# EAGLE design clock (EAGLE 8.7.0)
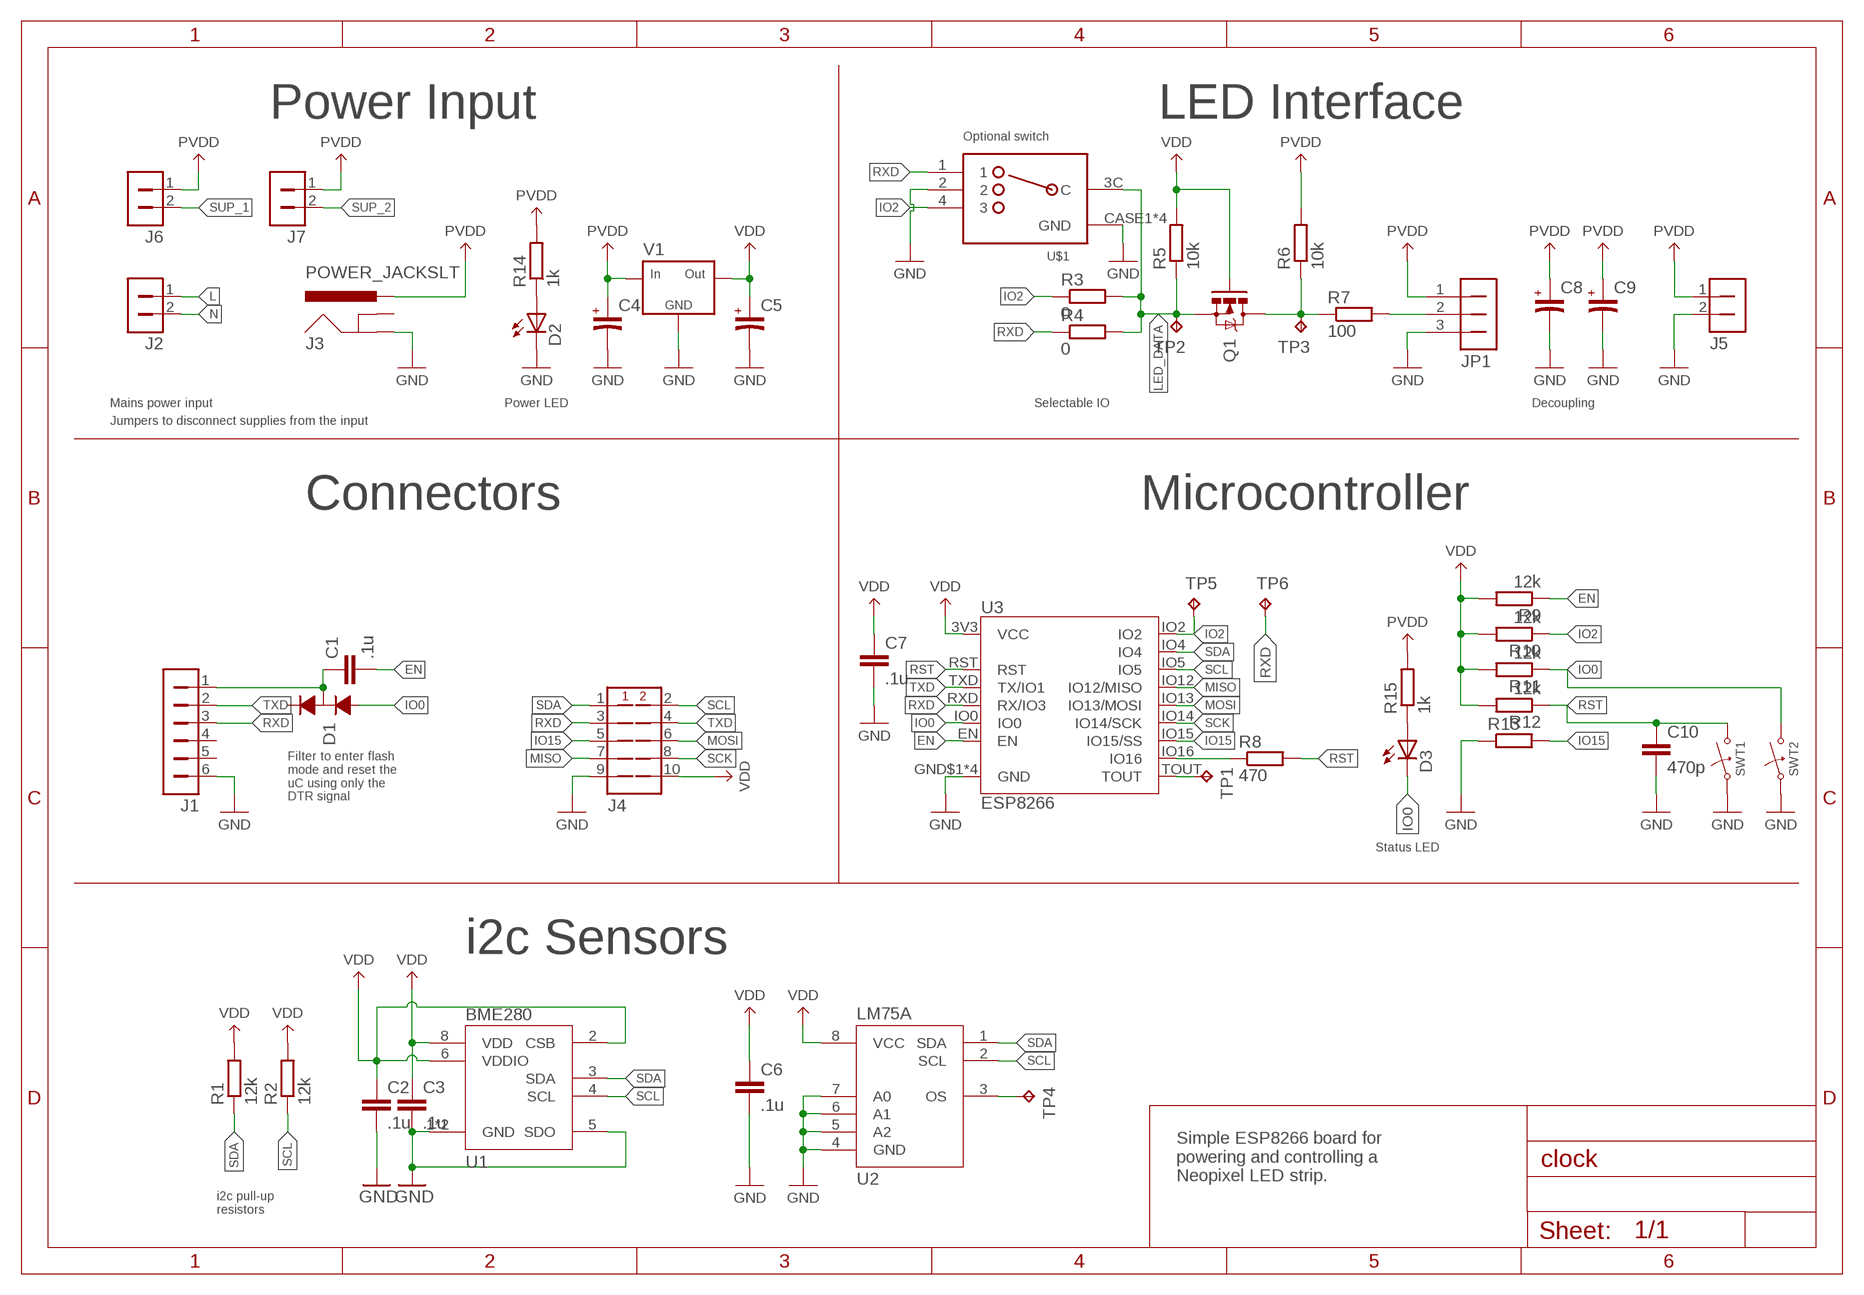
[diagram p0: schematic, sheet 1]

## Parts
C1  .1u  C_0603  [0603]
C2  .1u  C_0603  [0603]
C3  .1u  C_0603  [0603]
C4  C_POL_1206  [1206_POL]
C5  C_POL_1206  [1206_POL]
C6  .1u  C_0603  [0603]
C7  .1u  C_0603  [0603]
C8  C_POL_AVE_X  [AVE_X]
C9  C_POL_AVE_X  [AVE_X]
C10  470p  C_0603  [0603]
D1  SBAV99WT1G  [SC70]
D2  LED_0805  [0805_LED]
D3  LED_0805  [0805_LED]
J1  1X6_RIGHT  [1X6_RIGHT]
J2  1X2_IEC_C8_RIGHT  [IEC_C8_RIGHT]
J3  POWER_JACKSLT  [POWER_JACK_SLOT]
J4  2X5  [2X5]
J5  1X2_MOLEX_53254  [1X2_MOLEX_53254]
J6  1X2  [1X2]
J7  1X2  [1X2]
JP1  1X3_MOLEX_53254  [1X3_MOLEX_53254]
Q1  NMOS_2N7002  [SOT23]
R1  12k  R_0603  [0603]
R2  12k  R_0603  [0603]
R3  0  R_0603  [0603]
R4  0  R_0603  [0603]
R5  10k  R_0603  [0603]
R6  10k  R_0603  [0603]
R7  100  R_0603  [0603]
R8  470  R_0603  [0603]
R9  12k  R_0603  [0603]
R10  12k  R_0603  [0603]
R11  12k  R_0603  [0603]
R12  12k  R_0603  [0603]
R13  R_0603  [0603]
R14  1k  R_0603  [0603]
R15  1k  R_0603  [0603]
SWT1  BUTTON_SMD_2P  [BTN_SMD_2PIN]
SWT2  BUTTON_SMD_2P  [BTN_SMD_2PIN]
TP1  TPTP15R  [TP15R]
TP2  TPTP15R  [TP15R]
TP3  TPTP15R  [TP15R]
TP4  TPTP15R  [TP15R]
TP5  TPTP15R  [TP15R]
TP6  TPTP15R  [TP15R]
U1  BME280  [BME280]
U2  LM75A_SO8  [SO8]
U3  ESP8266_13  [ESP13]
U$1  SWITCH_1P3T_SSSS812201  [SSSS812201]
V1  NCP1117  [TO252]

## Nets
EN: C1.2 R9.1 U3.EN
GND: C2.2 C3.2 C4.2 C5.2 C6.2 C7.2 C8.- C9.- C10.2 D2.C J1.6 J3.GND@2(GND) J4.9 J5.2 JP1.3 R13.1 SWT1.1 SWT2.1 U1.1(GND) U1.5(SDO) U1.7(GND) U2.4(GND) U2.5(A2) U2.6(A1) U2.7(A0) U3.GND$1(GND) U3.GND$2(GND) U3.GND$3(GND) U3.GND$4(GND) U$1.2 U$1.CASE1(GND) U$1.CASE2(GND) U$1.CASE3(GND) U$1.CASE4(GND) V1.1(GND)
IO0: D1.1(ANODE) D3.C R11.1 SWT2.2 U3.IO0
IO2: R3.1 R10.1 TP5.TP U3.IO2 U$1.4
IO15: J4.5 R13.2 U3.IO15(IO15/SS)
L: J2.1
LED_DATA: Q1.2(S) R3.2 R4.2 R5.1 TP2.TP U$1.3C(C)
MISO: J4.7 U3.IO12(IO12/MISO)
MOSI: J4.6 U3.IO13(IO13/MOSI)
N: J2.2
N$1: TP4.TP U2.3(OS)
N$2: Q1.3(D) R6.1 R7.1 TP3.TP
N$3: JP1.2 R7.2
N$4: D2.A R14.1
N$5: D3.A R15.1
N$10: TP1.TP U3.TOUT
N$14: R8.1 U3.IO16
N$15: C1.1 D1.3(MIDDLE) J1.1
PVDD: C4.1 C8.+ C9.+ J3.PWR J5.1 J6.1 J7.1 JP1.1 R6.2 R14.2 R15.2 V1.2(IN)
RST: C10.1 R8.2 R12.1 SWT1.2 U3.RST
RXD: J1.3 J4.3 R4.1 TP6.TP U3.RXD(RX/IO3) U$1.1
SCK: J4.8 U3.IO14(IO14/SCK)
SCL: J4.2 R2.1 U1.4(SCL) U2.2(SCL) U3.IO5
SDA: J4.1 R1.1 U1.3(SDA) U2.1(SDA) U3.IO4
SUP_1: J6.2
SUP_2: J7.2
TXD: J1.2 J4.4 U3.TXD(TX/IO1)
VDD: C2.1 C3.1 C5.1 C6.1 C7.1 J4.10 Q1.1(G) R1.2 R2.2 R5.2 R9.2 R10.2 R11.2 R12.2 U1.2(CSB) U1.6(VDDIO) U1.8(VDD) U2.8(VCC) U3.3V3(VCC) V1.3(OUT)
Unconnected: D1.2(CATHODE) J1.4 J1.5 J3.GND@1(GNDBREAK)

## Notes on the sheet
- Power Input | LED Interface
- Optional switch
- Mains power input | Power LED | Selectable IO | Decoupling
- Jumpers to disconnect supplies from the input
- Connectors | Microcontroller
- Filter to enter flash
  mode and reset the 
  uC using only the 
  DTR signal
- Status LED
- i2c Sensors
- Simple ESP8266 board for
  powering and controlling a 
  Neopixel LED strip.
- i2c pull-up
  resistors

## Library data of the parts
C1-C3 C6 C7 C10 = Sebastian:C
C4 C5 C8 C9 = Sebastian:C_POL
D1 = Sebastian:SBAV99WT1G: Dual Series Switching Diodes - Datasheet <http://www.mouser.com/ds/2/308/BAV99WT1-D-101048.pdf> Suggested Applications ESD Protection Polarity Reversal Protection Data Line Protection Inductive Load Protection Steering Logic
D2 D3 = Sebastian:LED
J1 = Sebastian:1X6
J2 J5 = Sebastian:1X2
J3 = SparkFun-Connectors:POWER_JACK: Power Jack This is the standard 5.5mm barrel jack for power. The PTH is the most common, proven, reliable, footprint. The Slot footprint only works if the mill layer is transmitted to the PCB fab house so be warned. Spark Fun Electronics SKU : PRT-00119 SMT: CONN-08106 Mating wall wart : TOL-00298 (and others)
J4 = Sebastian:2X5
J6 J7 = Connectors:1X2
JP1 = Sebastian:1X3
Q1 = Sebastian:NMOS
R1-R15 = Sebastian:R
SWT1 SWT2 = Sebastian:BUTTON
TP1-TP6 = testpad:TP: Test pad
U1 = Sebastian:BME280
U2 = Sebastian:LM75A
U3 = Modules:ESP8266
U$1 = Sebastian:SWITCH_1P3T
V1 = Sebastian:NCP1117: NCP1117 1.0 A Low-Dropout Positive Fixed Voltage Regulator - Datasheet <http://www.mouser.com/ds/2/308/NCP1117-D-81326.pdf> - Mouser <http://se.mouser.com/ProductDetail/ON-Semiconductor/NCP1117DT33G/?qs=sGAEpiMZZMug9GoBKXZ754bzE5DUjIrfWRe2W%2f6FisE%3d> The NCP1117 series are low dropout positive voltage regulators that are capable of providing an output current that is in excess of 1.0 A with a maximum dropout voltage of 1.2 V at 800 mA over temperature. Output Current in Excess of 1.0 A 1.2 V Maximum Dropout Voltage at 800 mA Over Temperature No Minimum Load Requirement for Fixed Voltage Output Devices Operation to 20 V Input

## Board
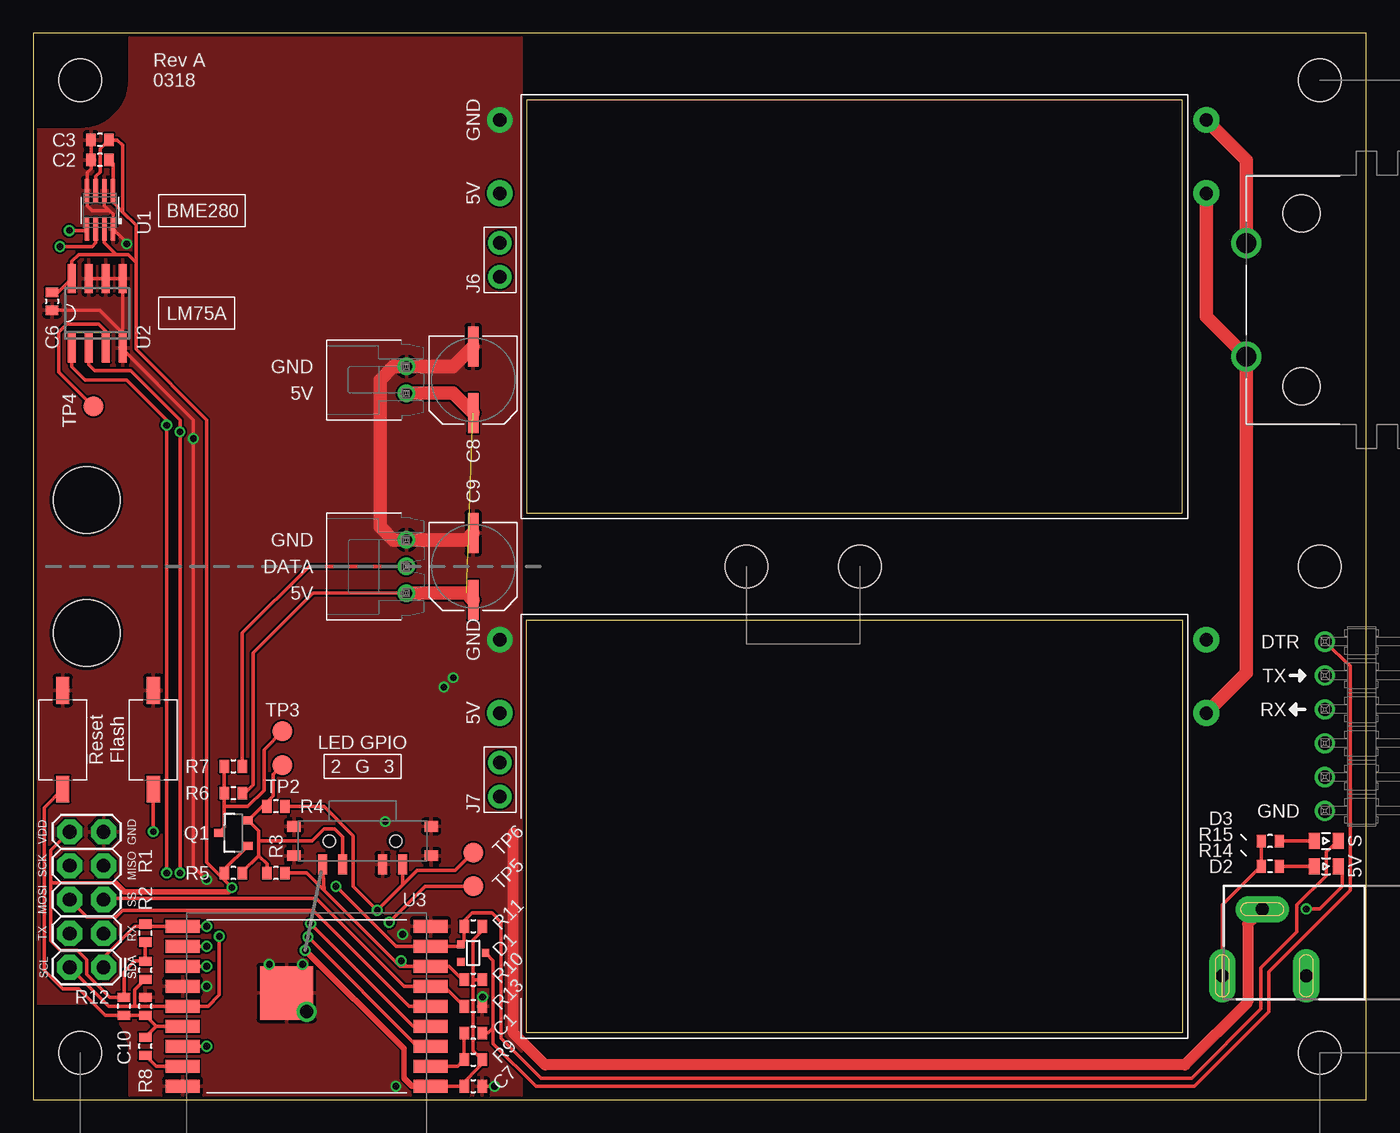
[diagram p1: board, top side]
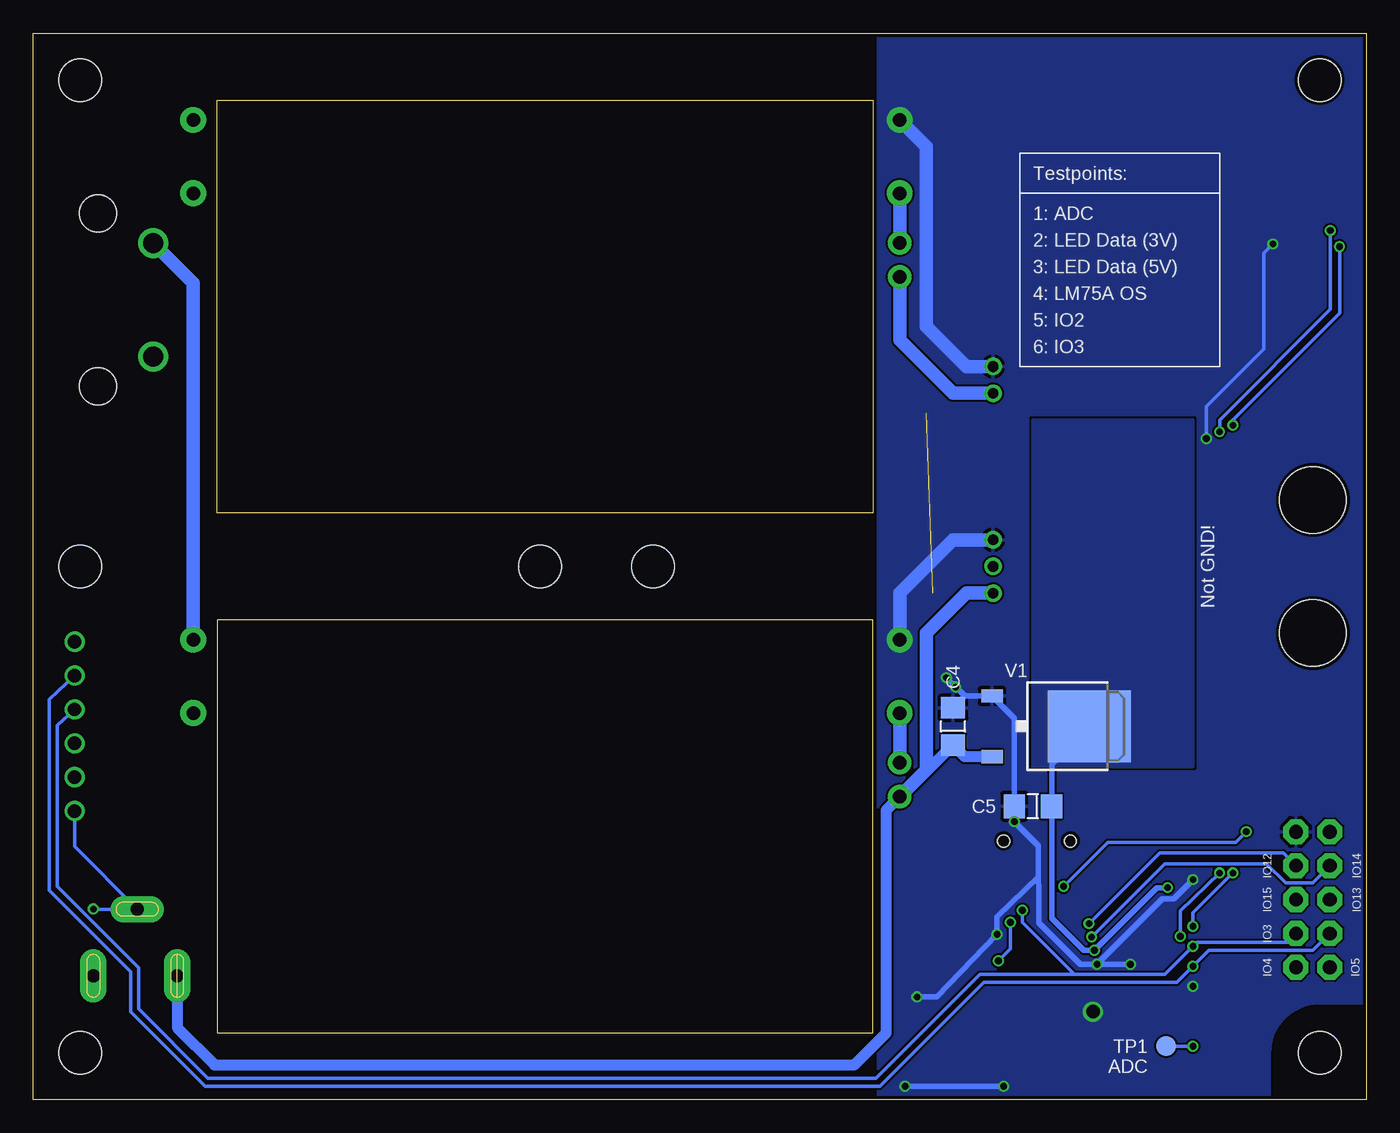
[diagram p2: board, bottom side, seen from below]

Size 100 x 80 mm. Coordinates in mm from the lower left corner, seen from the top.
Outline: 0,0 100,0 100,80 0,80 0,0
Outline: 37,36 86.2,36 86.2,5 37,5 37,36
Outline: 37,44 86.2,44 86.2,75 37,75 37,44
Copper layers (1*16): Top 0.035mm / dielectric 1.5mm / Bottom 0.035mm
Design rules "SeeedStudio_2layer_DRU_no_angle_20140221": minimum track width 6mil, minimum drill 12mil, track to track 6mil, track to pad 6mil, pad to pad 6mil, via to via 6mil, smd to smd 0mil, copper to edge 10mil, drill to drill 10mil, minimum pad ring 10mil, minimum via ring 6mil, stop-mask expansion 2mil, vias tented up to drill 100mil, thermal gap 10mil
Holes 3.2 mm at 3.5,76.5 96.5,76.5 96.5,3.5 3.5,3.5 96.5,40 62,40 53.5,40
Holes 5 mm at 4,35 4,45
bKeepout: area 93,73 to 100,80; area 93,0 to 100,7; area 0,0 to 7,7; area 0,73 to 7,80; area 93,36.5 to 100,43.5; area 50,36.5 to 57,43.5; area 58.5,36.5 to 65.5,43.5
Milling: 8 lines

### Footprints (pad centres in the part's own frame; a part is rotated, then mirrored left to right if it is on the bottom)
0603 = smd 0.7 x 0.95: 1 -0.675,0; 2 0.675,0
1206_POL = smd 1.6 x 1.8: 1 -1.4,0; 2 1.4,0
AVE_X = smd 3 x 0.8: + 2.5,0; - -2.5,0
SC70 = smd 0.6 x 0.55: 1 -0.65,-0.925; 2 0.65,-0.925; 3 0,0.925
0805_LED = smd 0.8 x 1.2: A -0.9,0; C 0.9,0
1X6_RIGHT = drill 1: 1 -6.35,0; 2 -3.81,0; 3 -1.27,0; 4 1.27,0; 5 3.81,0; 6 6.35,0
IEC_C8_RIGHT = drill 1.5: 1 -4.25,0; 2 4.24,0 | hole 2.8: 6.49,4.15; -6.49,4.15
POWER_JACK_SLOT = drill 1 pad 2 long: GND@1 2.58,7.5; GND@2 7.58,10.8; PWR 2.58,13.8
2X5 = drill 1.016 pad 1.88 octagon: 1 -5.08,-1.27; 2 -5.08,1.27; 3 -2.54,-1.27; 4 -2.54,1.27; 5 0,-1.27; 6 0,1.27; 7 2.54,-1.27; 8 2.54,1.27; 9 5.08,-1.27; 10 5.08,1.27
1X2_MOLEX_53254 = drill 0.8: 1 -1,0; 2 1,0
1X2 = drill 1 pad 1.778: 1 -1.27,0; 2 1.27,0
1X3_MOLEX_53254 = drill 0.8: 1 -2,0; 2 0,0; 3 2,0
SOT23 = smd 0.6 x 0.7: 1 -0.95,-1.1; 2 0.95,-1.1; 3 0,1.1
BTN_SMD_2PIN = smd 2 x 1: 1 -3.7,0; 2 3.7,0
TP15R = smd 1.5 x 1.5: TP 0,0
BME280 = smd 1.725 x 0.35: 1 1.4,0.975; 2 1.4,0.325; 3 1.4,-0.325; 4 1.4,-0.975; 5 -1.5,-0.975; 6 -1.5,-0.325; 7 -1.5,0.325; 8 -1.5,0.975
SO8 = smd 0.6 x 2.2: 1 -1.905,-2.6; 2 -0.635,-2.6; 3 0.635,-2.6; 4 1.905,-2.6; 5 1.905,2.6; 6 0.635,2.6; 7 -0.635,2.6; 8 -1.905,2.6
ESP13 = smd 2.54 x 1: 3V3 -9.3,3; EN -9.3,1.5; GND$1 9.3,-4.5; GND$2 9.3,3; GND$3 -9.3,-9; IO0 -9.3,-7.5; IO2 -9.3,-6; IO4 9.3,-9; IO5 9.3,-3; IO12 -9.3,-1.5; IO13 -9.3,-3; IO14 -9.3,0; IO15 -9.3,-4.5; IO16 9.3,1.5; RST 9.3,-1.5; RXD 9.3,-7.5; TOUT 9.3,0; TXD 9.3,-6 | smd 4 x 4: GND$4 1.5,-4
SSSS812201 = smd 0.7 x 1.5: 1 -3,1.75; 2 -1.5,1.75; 3C 1.5,1.75; 4 3,1.75 | smd 1 x 0.8: CASE1 -5.15,1.1; CASE2 5.15,1.1; CASE3 5.15,-1.1; CASE4 -5.15,-1.1 | hole 0.9: 2.5,0; -2.5,0
TO252 = smd 1 x 1.6: 1 -2.28,-6.07; 2 2.28,-6.07 | smd 5.4 x 6.2: 3 0,1.23

### Placement (x,y rotation side)
C1  33,5 180 top
C2  5,70.5 180 top
C3  5,72 180 top
C4  31,28 90 bottom
C5  25,22 180 bottom
C6  1.4,59.9 270 top
C7  33,1 0 top
C8  33,54 270 top
C9  33,40 270 top
C10  8.4,7 90 top
D1  33,11 270 top
D2  97,17.5 0 top
D3  97,19.4 0 top
J1  96.9,28 270 top
J2  91,60 270 top
J3  103,6.7 90 top
J4  4,15 90 top
J5  28,54 90 top
J6  35,63 90 top
J7  35,24 90 top
JP1  28,40 90 top
Q1  15,20 90 top
R1  8.4,12.5 270 top
R2  8.4,9.7 90 top
R3  18.2,17 180 top
R4  18.2,22 180 top
R5  15,17 180 top
R6  15,23 0 top
R7  15,25 0 top
R8  8.4,4 90 top
R9  33,3 0 top
R10  33,9 0 top
R11  33,13 0 top
R12  6.8,7 90 top
R13  33,7 180 top
R14  92.8,17.5 180 top
R15  92.8,19.4 180 top
SWT1  2.2,27 270 top
SWT2  9,27 270 top
TP1  15,4 0 bottom
TP2  18.7,25.1 0 top
TP3  18.7,27.64 0 top
TP4  4.5,52 0 top
TP5  33,16 0 top
TP6  33,18.54 0 top
U1  5,66.7 270 top
U2  4.8,59 0 top
U3  20.5,4 180 top
U$1  24.7,19.4 180 top
V1  22,28 270 bottom

### Tracks (layer width: path | path; a pad name or v marks a point on that pad's centre or on a via)
EN
  Top 0.254: C1.2 R9.1 31.82,2.5 U3.EN
GND  (via drill 0.5, 1, 1 pad 1.93)
  Top 0.254: 33.67,6.67 R13.1 33.67,7.67 v33.7,7.7 | C7.2 v34.6,1 | v13,16.5 12,17.5 v12,49.6 12,51 6.71,56.3 U2.4 6.71,57.5 | U2.7 U2.6 U2.5 6.71,57.5 | C6.2 4.98,59.23 6.71,57.5 | C3.2 C2.2 4.33,69.83 4.03,69.53 U1.5 4.03,67.08 4.4,66.7 5.7,66.7 | U1.7 5.33,67.08 5.7,66.7 | 5.7,66.7 5.97,66.42 U1.1 7,64.28 v7,64.2 | 93.28,14.58 J3.GND@2 93.38,14.58 | v95.5,14.3 96.5,14.3 98.2,16 98.2,17.2 D2.C 98,17.4 98,17
  Top 0.813: J3.GND@2 91.1,13.18 91.1,7.3 86.4,2.6 38.4,2.6 36,5 36,20
  Top 1.016: C9.- 32.5,42 JP1.3 27,42 26,43 26,54 27,55 J5.2 31.5,55 C8.-
  Bottom 0.254: v12,49.6 12,52 7.7,56.3 7.7,63.5 v7,64.2 | 92.2,14.58 J3.GND@2 | J3.GND@2 95.48,14.28 v95.5,14.3 | J1.6 96.9,18.98 J3.GND@2
  Bottom 0.406: v31.5,31.65 v30.8,30.95 v30.79,30.95 30.12,30.28 | 30.12,30.28 V1.1 26.4,28.61 C5.2 v26.4,20.85 24.6,19.05 24.55,13.25 21.45,10.15 v20.2,10.15 | 30.12,30.28 C4.2 | v20.2,10.15 v17.7,10.15 | v34.6,1 v27.2,1 | v33.7,7.7 32.2,7.7 v27.7,12.4 27.7,13.7 24.6,16.7 | v20.2,10.15 15.3,15.05 14.45,15.05 v13,16.5
  Bottom 1.016: JP1.3 31,42 35,38 v35,34.5 | J5.2 30,55 33,58 33,71.5 v35,73.5
  other vias: 13,8.5 20.5,6.6
  pour Top (rank 6): 36.6,-1 36.6,80 -1,80 -1,-1
  pour Bottom (rank 6): 36.6,-1 36.6,80 0,80 0,-1
IO0  (via drill 0.5)
  Top 0.254: v22.7,16 27.2,11.5 U3.IO0 31.93,11.5 D1.1 32.33,11.9 R11.1 32.33,13.43 32.9,14 34.4,14 35.1,13.3 35.1,4.6 38.1,1.6 86.9,1.6 92.1,6.8 92.1,9.9 94.8,12.6 94.8,14.6 97,16.8 97,18.6 D3.C | v9,20.1 SWT2.2
  Bottom 0.254: v22.7,16 19.4,19.3 9.8,19.3 v9,20.1
IO2  (via drill 0.5)
  Top 0.254: R10.1 32.2,9 31.2,10 U3.IO2 28,10 | 28,10 27.5,10 21.8,15.7 | U$1.4 21.8,15.7 | R3.1 20.5,17 21.8,15.7 | v27.6,10.4 28,10 | v26.7,13.3 29.4,16 TP5.TP
  Bottom 0.254: v27.6,10.4 26.7,11.3 v26.7,13.3
IO15
  Top 0.254: R13.2 30.82,8.5 U3.IO15 27.8,8.5 21.2,15.1 5.37,15.1 J4.5
L  (via drill 1 pad 1.93)
  Top 1.016: J2.1 91,70.5 v88,73.5
  Bottom 1.016: v88,34.5 88,61.25 J2.1
LED_DATA
  Top 0.254: R5.1 15.68,17.07 16.9,18.3 | 16.9,18.3 16.9,19.5 | 16.9,19.5 16.9,20.15 Q1.2 17.15,22 R4.2 17.52,22.32 18,22.8 18,24.4 TP2.TP | U$1.3C 23.2,19.7 22.6,20.3 21.8,20.3 20.9,19.4 17,19.4 16.9,19.5 | R3.2 17.52,17.68 16.9,18.3
MISO  (via drill 0.5)
  Top 0.254: U3.IO12 28.5,5.5 v20.8,13.2
  Bottom 0.254: 5.29,17.54 J4.7 6.23,18.5 15.5,18.5 v20.8,13.2
MOSI
  Top 0.254: U3.IO13 28.2,7 21,14.2 6.7,14.2 6.22,13.72 4,13.72 J4.6
N  (via drill 1 pad 1.93)
  Top 1.016: v88,68 88,58.76 J2.2 91,32 v88,29
N$1
  Top 0.254: U2.3 5.43,57.66 4.9,58.2 2.5,58.2 1.9,57.6 1.9,54.6 TP4.TP
N$2
  Top 0.254: 14.32,21.99 R6.1 R7.1 | 14.32,21.99 14.32,20.43 Q1.3 | 14.32,21.99 16.09,21.99 17.3,23.2 17.3,26.24 TP3.TP
N$3
  Top 0.254: JP1.2 20.68,40 15.68,35 R7.2
N$4
  Top 0.254: R14.1 D2.A
N$5
  Top 0.254: R15.1 D3.A
N$10  (via drill 0.5)
  Top 0.254: U3.TOUT v13,4
  Bottom 0.254: v13,4 TP1.TP
N$12
  cutout Top: 0,7 3.5,7 arc-90 7,3.5 7,0 0,0
  cutout Bottom: 0,7 3.5,7 arc-90 7,3.5 7,0 0,0
N$13
  cutout Top: 0,73 3.5,73 arc90 7,76.5 7,80 0,80
N$14
  Top 0.254: U3.IO16 9.22,2.5 R8.1
N$15
  Top 0.254: C1.1 33.67,5.33 34,5 34.1,5 34.5,5.4 | D1.3 34.5,10.43 34.5,5.4 | 34.5,5.4 34.5,4.2 37.7,1 87.1,1 92.7,6.6 92.7,9.6 98.8,15.7 98.8,32.55 J1.1
PVDD  (1 unrouted)
  Top 0.254: JP1.1 21,38 16.5,33.5 16.5,23.6 15.9,23 R6.2 | J3.PWR 89.2,14.59 92.12,17.51 R14.2 R15.2
  Top 1.016: C9.+ 32.5,38 JP1.1 | C8.+ 31.5,53 J5.1
  Bottom 0.813: J3.PWR 89.2,5.4 86.4,2.6 38.4,2.6 36,5 36,21.73 35.37,22.36 J7.1 34.87,22.73 C4.1 30.12,25.72 V1.2
  Bottom 1.016: JP1.1 30,38 33,35 33,24.73 35.37,22.36 | J5.1 31,53 35,57 J6.1
RST
  Top 0.254: U3.RST 9.22,5.5 | 9.22,5.5 C10.1 R12.1 5.38,6.33 3.4,8.3 2.2,8.3 0.8,9.7 0.8,21.9 SWT1.2 | 9.22,5.5 R8.2
RXD  (via drill 0.5)
  Top 0.254: v13,11.5 U3.RXD | U$1.1 27.7,16.1 | 27.7,16.1 v25.8,14.2 24,16 24,19.8 21.8,22 R4.1 | TP6.TP 31.66,17.2 28.8,17.2 27.7,16.1
  Bottom 0.254: 21.9,9.4 15.1,9.4 v13,11.5 12.7,11.8 5.93,11.8 J4.3 | 21.9,9.4 29,9.4 36.8,1.6 86.9,1.6 92.1,6.8 92.1,9.9 98.2,16 98.2,28.07 J1.3 | v25.8,14.2 25.8,13.3 21.9,9.4
SCK  (via drill 0.5)
  Top 0.254: U3.IO14 28.8,4 v20.6,12.2
  Bottom 0.254: v20.6,12.2 15.1,17.7 7.5,17.7 6.05,16.25 4.02,16.25 J4.8
SCL  (via drill 0.5)
  Top 0.254: 7.6,7 U3.IO5 13.1,7 13.95,7.85 v13.95,12.25 | 7.6,7 5.65,7 J4.2 | R2.1 7.6,8.22 7.6,7 | v11,17 v11,50.1 11,51 7.3,54.7 4.6,54.7 4.17,55.13 U2.2 | v2.7,65.2 3.92,65.2 U1.4
  Bottom 0.254: v13.95,12.25 13.95,14.15 v11,17 | v11,50.1 11,51 2.7,59.3 v2.7,65.2
SDA  (via drill 0.5)
  Top 0.254: 8.35,13 U3.IO4 v13,13 | 8.35,13 8.4,13.05 R1.1 | 8.35,13 7.6,13 5.27,10.67 J4.1 | v10,17 v10,50.6 10,51 7,54 3.9,54 2.9,55.01 U2.1 | v2,64 4.4,64 4.67,64.28 U1.3
  Bottom 0.254: v13,13 13,14 v10,17 | v10,50.6 10,51 2,59 v2,64
SUP_1  (via drill 1 pad 1.93)
  Bottom 1.016: v35,68 J6.2
SUP_2  (via drill 1 pad 1.93)
  Bottom 1.016: v35,29 J7.2
TXD  (via drill 0.5)
  Top 0.254: v13,10 U3.TXD
  Bottom 0.254: J1.2 98.8,30.01 98.8,15.7 92.7,9.6 92.7,6.6 87.1,1 36.5,1 28.7,8.8 14.2,8.8 v13,10 11.8,11.2 3.99,11.2 J4.4
VDD  (via drill 0.5)
  Top 0.254: 32,1 33.67,2.67 R9.2 33,3.67 33,9 | R11.2 33.67,12.68 33,12 33,9 | R10.2 33,9 | U3.3V3 32,1 | J4.10 2.68,20.08 1.3,18.7 1.3,16.4 | 1.3,16.4 1.3,11.9 2,11.2 3.3,11.2 4,10.5 4,9.4 5.72,7.67 R12.2 6.8,9.6 7.6,10.4 8.38,10.4 R2.2 R1.2 | C7.1 32,1 | Q1.1 14.32,17.27 R5.2 14.32,16.48 | 14.32,16.48 v14.9,15.9 | 6.15,16.25 1.45,16.25 1.3,16.4 | 14.32,16.48 13,17.8 13,51 7.7,56.3 7.7,62.8 | 6.2,63.4 7.1,63.4 7.7,62.8 | 6.2,63.4 3.4,63.4 2.9,62.9 U2.8 1.87,60.58 C6.1 | C2.1 5.97,70.2 U1.8 5.97,67.33 6.7,66.6 | U1.6 4.67,69.28 5,69.6 5,71.33 C3.1 6.3,72 6.7,71.6 6.7,66.6 | U1.2 5.33,64.28 6.2,63.4 | 7.7,62.8 7.7,65.6 6.7,66.6
  Top 0.406: U3.3V3 28.4,1 27.8,1.6 27.8,3.8 v20.4,11.2 | v14.9,15.9 14.6,15.6 6.8,15.6 6.15,16.25
  Bottom 0.406: V1.3 23.6,25.17 C5.1 23.6,13.6 21.2,11.2 v20.4,11.2 15.7,15.9 v14.9,15.9
  pour Bottom (no thermals): 13,51 25,51 25,25 13,25

### Text on the board
tPlace: Rev A | 0318 | GND | 5V | BME280 | LM75A | GND | 5V | GND | DATA | 5V | GND | DTR | TX | 5V | RX | Reset | Flash | LED GPIO | 2 | G | 3 | GND | VDD | GND | S | SCK | MISO | 5V | MOSI | SS | TX | RX | SCL | SDA | SDA
bPlace: Testpoints: | 1: ADC | 2: LED Data (3V) | 3: LED Data (5V) | 4: LM75A OS | 5: IO2 | 6: IO3 | Not GND! | IO14 | IO12 | IO13 | IO15 | IO3 | IO5 | IO4 | ADC
tDocu: M3 screw size | 5V AC/DC | For zip-tying the / cables to LED-strip | For strapping down / the transformers | 5V AC/DC